# Altium schematic sheet Core.SchDoc
size A4
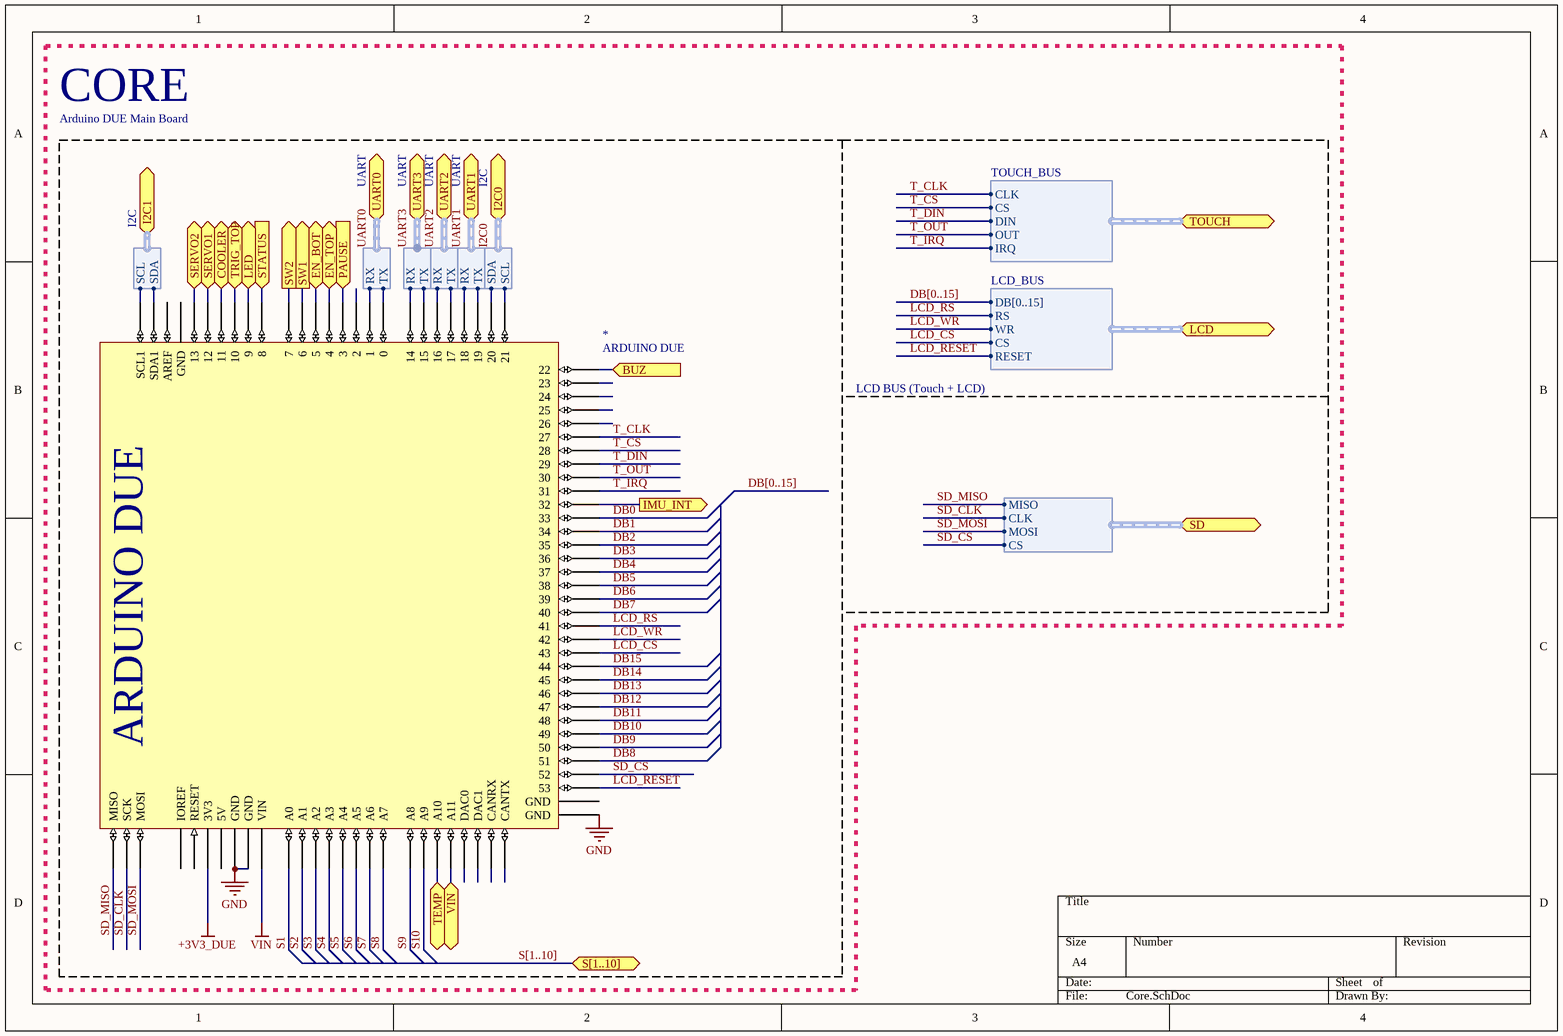
[diagram p0: Core.SchDoc]

## Parts
*  ARDUINO DUE  [ARDUINO-DUE]

## Blocks framed on the sheet
Arduino DUE Main Board: *

## Ports
BUZ (in), COOLER, EN_BOT, EN_TOP, I2C0 (harness I2C), I2C1 (harness I2C), IMU_INT (out), LCD (harness LCD_BUS), LED, PAUSE (in), S[1..10], SD (harness SD), SERVO1, SERVO2, STATUS (in), SW1 (out), SW2 (out), TEMP, TOUCH (harness TOUCH_BUS), TRIG_TOP, UART0 (harness UART), UART1 (harness UART), UART2 (harness UART), UART3 (harness UART), VIN

## Harnesses
LCD_BUS: CS, DB[0..15], RESET, RS, WR
TOUCH_BUS: CLK, CS, DIN, OUT, IRQ
UART: RX, TX
I2C: SDA, SCL
SD: MISO, MOSI, CLK, CS

## Nets
+3V3_DUE: *.3V3
GND: *.GND2(GND) *.GND3(GND) *.GND5(GND)
VIN: *.VIN
BUZ: *.22 ; port BUZ
COOLER: *.11 ; port COOLER
DB0: *.33
DB1: *.34
DB2: *.35
DB3: *.36
DB4: *.37
DB5: *.38
DB6: *.39
DB7: *.40
DB8: *.51
DB9: *.50
DB10: *.49
DB11: *.48
DB12: *.47
DB13: *.46
DB14: *.45
DB15: *.44
EN_BOT: *.5 ; port EN_BOT
EN_TOP: *.4 ; port EN_TOP
IMU_INT: *.32 ; port IMU_INT
LCD_CS: *.43 ; port LCD.CS
LCD_RESET: *.53 ; port LCD.RESET
LCD_RS: *.41 ; port LCD.RS
LCD_WR: *.42 ; port LCD.WR
LED: *.9 ; port LED
PAUSE: *.3 ; port PAUSE
S1: *.A0
S2: *.A1
S3: *.A2
S4: *.A3
S5: *.A4
S6: *.A5
S7: *.A6
S8: *.A7
S9: *.A8
S10: *.A9
SD_CLK: *.SCK ; port SD.CLK
SD_CS: *.52 ; port SD.CS
SD_MISO: *.MISO ; port SD.MISO
SD_MOSI: *.MOSI ; port SD.MOSI
SERVO1: *.12 ; port SERVO1
SERVO2: *.13 ; port SERVO2
STATUS: *.8 ; port STATUS
SW1: *.6 ; port SW1
SW2: *.7 ; port SW2
T_CLK: *.27 ; port TOUCH.CLK
T_CS: *.28 ; port TOUCH.CS
T_DIN: *.29 ; port TOUCH.DIN
T_IRQ: *.31 ; port TOUCH.IRQ
T_OUT: *.30 ; port TOUCH.OUT
TEMP: *.A10 ; port TEMP
TRIG_TOP: *.10 ; port TRIG_TOP
VIN: *.A11 ; port VIN  [a separate net that carries the same name]
Net*_0: *.0 ; port UART0.TX
Net*_1: *.1 ; port UART0.RX
Net*_14: *.14 ; port UART3.RX
Net*_15: *.15 ; port UART3.TX
Net*_16: *.16 ; port UART2.RX
Net*_17: *.17 ; port UART2.TX
Net*_18: *.18 ; port UART1.RX
Net*_19: *.19 ; port UART1.TX
Net*_20: *.20 ; port I2C0.SDA
Net*_21: *.21 ; port I2C0.SCL
Net*_SCL1: *.SCL1 ; port I2C1.SCL
Net*_SDA1: *.SDA1 ; port I2C1.SDA

Not connected (* = marked no-connect by the designer): * 2 5V 23 24 25 26 AREF CANRX CANTX DAC0 DAC1 GND1(GND) GND4(GND) IOREF RESET

## Buses and harness runs
bus DB[0..15]
bus S[1..10] = port S[1..10]

## Notes on the sheet
- CORE
- LCD BUS (Touch + LCD)
- Labels drawn without touching a wire or pin: I2C0, UART0, UART1, UART2, UART3